# EAGLE schematic Sport Analyzer Chronojump Teensy 4 (4 buttons) (EAGLE 9.6.2)
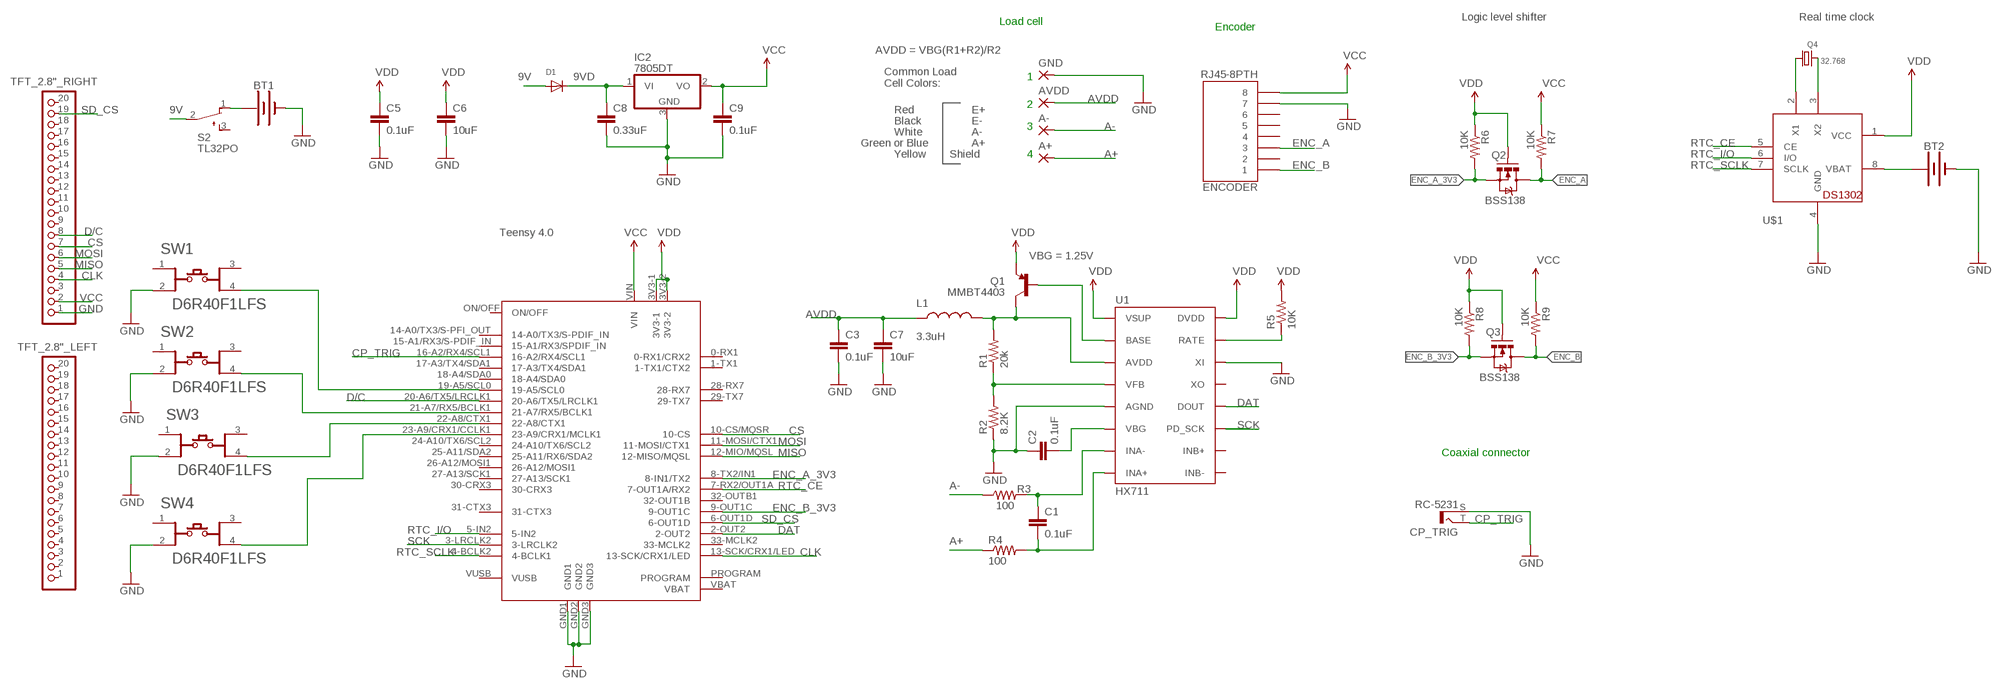
[diagram p0: schematic, sheet 1]

## Parts
A+  3,81/1,4  [3,81/1,4]
A-  3,81/1,4  [3,81/1,4]
AVDD  3,81/1,4  [3,81/1,4]
BT1  BATTERY-9V  [BATTCON_9V]
BT2  BATTERY-12MM_SMD  [BATTCON_12MM]
C1  0.1uF  0.1UF-25V-5%(0603)  [0603-CAP]
C2  0.1uF  0.1UF-25V-5%(0603)  [0603-CAP]
C3  0.1uF  0.1UF-25V-5%(0603)  [0603-CAP]
C5  0.1uF  0.1UF-25V-5%(0603)  [0603-CAP]
C6  10uF  10UF50V20%(1210)  [1210]
C7  10uF  10UF50V20%(1210)  [1210]
C8  0.33uF  0.1UF-25V-5%(0603)  [0603-CAP]
C9  0.1uF  0.1UF-25V-5%(0603)  [0603-CAP]
CP_TRIG  RC-5231  [RC-5231]
D1  DIODESOD-123  [SOD-123]
ENCODER  RJ45-8PTH  [RJ45-8]
GND  3,81/1,4  [3,81/1,4]
IC2  7805DT  [TO252]
L1  3.3uH  INDUCTOR0805-IND  [0805]
Q1  MMBT4403  TRANSISTOR_PNPMMBT4403  [SOT23-3]
Q2  BSS138  MOSFET-NCHANNELSMD  [SOT23-3]
Q3  BSS138  MOSFET-NCHANNELSMD  [SOT23-3]
Q4  32.768  CRYSTAL8.0X3.8  [CRYSTAL_8X3.8]
R1  20k  20KOHM1/10W1%(0603)  [0603-RES]
R2  8.2K  8.2KOHM-1/10W-5%(0603)  [0603-RES]
R3  100  100OHM-1/10W-1%(0603)  [0603-RES]
R4  100  100OHM-1/10W-1%(0603)  [0603-RES]
R5  10K  10KOHM-1/10W-1%(0603)0603  [0603-RES]
R6  10K  RESISTOR0603-RES  [0603-RES]
R7  10K  RESISTOR0603-RES  [0603-RES]
R8  10K  RESISTOR0603-RES  [0603-RES]
R9  10K  RESISTOR0603-RES  [0603-RES]
S2  TL32PO  [TL3XPO]
SW1  C&K_COMPONENTS_D6R40F1LFSC&K_COMPONENTS_D6R40F1LFS_0_0  [C&K_COMPONENTS_D6R40F1LFS_0]
SW2  C&K_COMPONENTS_D6R40F1LFSC&K_COMPONENTS_D6R40F1LFS_0_0  [C&K_COMPONENTS_D6R40F1LFS_0]
SW3  C&K_COMPONENTS_D6R40F1LFSC&K_COMPONENTS_D6R40F1LFS_0_0  [C&K_COMPONENTS_D6R40F1LFS_0]
SW4  C&K_COMPONENTS_D6R40F1LFSC&K_COMPONENTS_D6R40F1LFS_0_0  [C&K_COMPONENTS_D6R40F1LFS_0]
TFT_2.8"_LEFT  PINHD-1X20  [1X20]
TFT_2.8"_RIGHT  PINHD-1X20  [1X20]
U1  HX711  HX711HX711  [SO16]
U$1  DS1302  [DIL08-ROUND]
U$2  TEENSY40  [TEENSY40]

## Nets
9V: D1.A S2.2(P)
9VD: C8.1 D1.C IC2.1(VI)
A+: A+.1(P) R4.1
A-: A-.1(P) R3.1
AVDD: AVDD.1(P) C3.1 C7.1 L1.1
CLK: TFT_2.8"_RIGHT.4 U$2.13-SCK/CRX1/LED
CP_TRIG: CP_TRIG.T U$2.16-A2/RX4/SCL1
CS: TFT_2.8"_RIGHT.7 U$2.10-CS/MQSR(10-CS)
D/C: TFT_2.8"_RIGHT.8 U$2.20-A6/TX5/LRCLK1
DAT: U1.12(DOUT) U$2.2-OUT2
ENC_A: ENCODER.3 Q2.3(D) R7.2
ENC_A_3V3: Q2.2(S) R6.2 U$2.8-TX2/IN1(8-IN1/TX2)
ENC_B: ENCODER.1 Q3.3(D) R9.2
ENC_B_3V3: Q3.2(S) R8.2 U$2.9-OUT1C
GND: BT1.- BT2.GND(-) C2.1 C3.2 C5.2 C6.2 C7.2 C8.2 C9.2 CP_TRIG.S ENCODER.7 GND.1(P) IC2.3(GND) R2.1 SW1.2 SW2.2 SW3.2 SW4.2 TFT_2.8"_RIGHT.1 U1.5(AGND) U1.14(XI) U$1.4(GND) U$2.GND1 U$2.GND2 U$2.GND3
MISO: TFT_2.8"_RIGHT.5 U$2.12-MIO/MQSL(12-MISO/MQSL)
MOSI: TFT_2.8"_RIGHT.6 U$2.11-MOSI/CTX1
N$1: R5.1 U1.15(RATE)
N$2: C1.1 R3.2 U1.7(INA-)
N$3: C1.2 R4.2 U1.8(INA+)
N$4: Q1.1(B) U1.2(BASE)
N$5: L1.2 Q1.3(C) R1.2 U1.3(AVDD)
N$6: R1.1 R2.2 U1.4(VFB)
N$7: C2.2 U1.6(VBG)
N$8: Q4.P$4 U$1.2(X1)
N$9: Q4.P$1 U$1.3(X2)
N$10: SW1.4 U$2.19-A5/SCL0
N$11: SW2.4 U$2.21-A7/RX5/BCLK1
N$12: SW3.4 U$2.22-A8/CTX1
N$13: SW4.4 U$2.23-A9/CRX1/CCLK1(23-A9/CRX1/MCLK1)
N$18: BT2.PWR@1(+) U$1.8(VBAT)
N$42: BT1.+ S2.1(O)
RTC_CE: U$1.5(CE) U$2.7-RX2/OUT1A(7-OUT1A/RX2)
RTC_I/O: U$1.6(I/O) U$2.5-IN2
RTC_SCLK: U$1.7(SCLK) U$2.4-BCLK2(4-BCLK1)
SCK: U1.11(PD_SCK) U$2.3-LRCLK2
SD_CS: TFT_2.8"_RIGHT.19 U$2.6-OUT1D
VCC: C9.1 ENCODER.8 IC2.2(VO) R7.1 R9.1 TFT_2.8"_RIGHT.2 U$2.VIN
VDD: C5.1 C6.1 Q1.2(E) Q2.1(G) Q3.1(G) R5.2 R6.1 R8.1 U1.1(VSUP) U1.16(DVDD) U$1.1(VCC) U$2.3V3-1 U$2.3V3-2
Unconnected: ENCODER.2 ENCODER.4 ENCODER.5 ENCODER.6 S2.3(S) SW1.1 SW1.3 SW2.1 SW2.3 SW3.1 SW3.3 SW4.1 SW4.3 TFT_2.8"_LEFT.1 TFT_2.8"_LEFT.2 TFT_2.8"_LEFT.3 TFT_2.8"_LEFT.4 TFT_2.8"_LEFT.5 TFT_2.8"_LEFT.6 TFT_2.8"_LEFT.7 TFT_2.8"_LEFT.8 TFT_2.8"_LEFT.9 TFT_2.8"_LEFT.10 TFT_2.8"_LEFT.11 TFT_2.8"_LEFT.12 TFT_2.8"_LEFT.13 TFT_2.8"_LEFT.14 TFT_2.8"_LEFT.15 TFT_2.8"_LEFT.16 TFT_2.8"_LEFT.17 TFT_2.8"_LEFT.18 TFT_2.8"_LEFT.19 TFT_2.8"_LEFT.20 TFT_2.8"_RIGHT.3 TFT_2.8"_RIGHT.9 TFT_2.8"_RIGHT.10 TFT_2.8"_RIGHT.11 TFT_2.8"_RIGHT.12 TFT_2.8"_RIGHT.13 TFT_2.8"_RIGHT.14 TFT_2.8"_RIGHT.15 TFT_2.8"_RIGHT.16 TFT_2.8"_RIGHT.17 TFT_2.8"_RIGHT.18 TFT_2.8"_RIGHT.20 U1.9(INB-) U1.10(INB+) U1.13(XO) U$2.0-RX1(0-RX1/CRX2) U$2.1-TX1(1-TX1/CTX2) U$2.14-A0/TX3/S-PFI_OUT(14-A0/TX3/S-PDIF_IN) U$2.15-A1/RX3/S-PDIF_IN(15-A1/RX3/SPDIF_IN) U$2.17-A3/TX4/SDA1 U$2.18-A4/SDA0 U$2.24-A10/TX6/SCL2 U$2.25-A11/SDA2(25-A11/RX6/SDA2) U$2.26-A12/MOSI1 U$2.27-A13/SCK1 U$2.28-RX7 U$2.29-TX7 U$2.30-CRX3 U$2.31-CTX3 U$2.32-OUTB1(32-OUT1B) U$2.33-MCLK2 U$2.ON/OFF U$2.PROGRAM U$2.VBAT U$2.VUSB

## Notes on the sheet
- Logic level shifter | Real time clock
- Load cell
- Encoder
- AVDD = VBG(R1+R2)/R2
- 1
- Common Load
  Cell Colors:
- 2
- Red | E+
- Black | E-
- 3
- White | A-
- Green or Blue | A+
- Yellow | Shield | 4
- Teensy 4.0
- VBG = 1.25V
- Coaxial connector

## Library data of the parts
A+ A- AVDD GND = wirepad_xavi:3,81/1,4: THROUGH-HOLE PAD
BT1 = SparkFun-Batteries:BATTERY: Battery - Single Cell A variety of battery chemistries, sizes, and footprints. Device List: 20MM_PTH - Coin Cell Battery Holder - 20mm (PTH) <https://www.sparkfun.com/products/783> 20MM_PTH_KIT- Coin Cell battery Holder - 20 mm (PTH) <http://www.sparkfun.com/products/783>kit version with special mask 6.8MM_PTH - Coin Cell Battery Holder - 6.8MM(SMD) <https://www.digikey.com/product-detail/en/seiko-instruments/MS621FE-FL11E/728-1057-ND/1889208?WT.srch=1&gclid=CNOQ5a6LzdQCFZS2wAodXCkE0g> 12MM_SMD - Coin Cell Battery Holder - 12mm (SMD) <https://www.sparkfun.com/products/10592> 12MM_PTH - Coin Cell Battery Holder - 12mm (PTH) <https://www.sparkfun.com/products/7948> 20MM_SMD - 20mm Coin Cell Battery Holder (SMD) (2 legs) Used on the Big Time Watch Kit <https://www.sparkfun.com/products/11734> 20MM_SMD_4LEGS - Coin Cell Battery Holder - 20mm (SMD) <https://www.sparkfun.com/products/11892> 20MM_SMD_4LEGS_OVERPASTE - Coin Cell Battery Holder - 20mm (SMD) <https://www.sparkfun.com/products/11892> (Over-paste on the legs) 24.5MM_PTH - Coin Cell Battery Holder - 24.5mm (PTH) <https://www.sparkfun.com/products/8863> 9V - 9V Battery Holder - PC Mount Used on the SparkFun SparkPunk Sound Kit <https://www.sparkfun.com/products/11177> and SparkFun SparkPunk Sequencer Kit <https://www.sparkfun.com/products/12707> 18650 - Battery Holder - 18650 (PTH) <https://www.sparkfun.com/products/13113> AA - Battery Holder - 1xAA (PTH) <https://www.sparkfun.com/products/7949> AAA - Battery Holder - 1xAAA (PTH) <https://www.sparkfun.com/products/12718> AA_KIT - Battery Holder - 1xAA (PTH) <https://www.sparkfun.com/products/7949> Special kit package - pads only have exposed copper on one side of the board. AAA_KIT - Battery Holder - 1xAAA (PTH) <https://www.sparkfun.com/products/12718> Special kit package - pads only have exposed copper on one side of the board.; PROD_ID: BATT-10855
BT2 = SparkFun-Batteries:BATTERY: Battery - Single Cell A variety of battery chemistries, sizes, and footprints. Device List: 20MM_PTH - Coin Cell Battery Holder - 20mm (PTH) <https://www.sparkfun.com/products/783> 20MM_PTH_KIT- Coin Cell battery Holder - 20 mm (PTH) <http://www.sparkfun.com/products/783>kit version with special mask 6.8MM_PTH - Coin Cell Battery Holder - 6.8MM(SMD) <https://www.digikey.com/product-detail/en/seiko-instruments/MS621FE-FL11E/728-1057-ND/1889208?WT.srch=1&gclid=CNOQ5a6LzdQCFZS2wAodXCkE0g> 12MM_SMD - Coin Cell Battery Holder - 12mm (SMD) <https://www.sparkfun.com/products/10592> 12MM_PTH - Coin Cell Battery Holder - 12mm (PTH) <https://www.sparkfun.com/products/7948> 20MM_SMD - 20mm Coin Cell Battery Holder (SMD) (2 legs) Used on the Big Time Watch Kit <https://www.sparkfun.com/products/11734> 20MM_SMD_4LEGS - Coin Cell Battery Holder - 20mm (SMD) <https://www.sparkfun.com/products/11892> 20MM_SMD_4LEGS_OVERPASTE - Coin Cell Battery Holder - 20mm (SMD) <https://www.sparkfun.com/products/11892> (Over-paste on the legs) 24.5MM_PTH - Coin Cell Battery Holder - 24.5mm (PTH) <https://www.sparkfun.com/products/8863> 9V - 9V Battery Holder - PC Mount Used on the SparkFun SparkPunk Sound Kit <https://www.sparkfun.com/products/11177> and SparkFun SparkPunk Sequencer Kit <https://www.sparkfun.com/products/12707> 18650 - Battery Holder - 18650 (PTH) <https://www.sparkfun.com/products/13113> AA - Battery Holder - 1xAA (PTH) <https://www.sparkfun.com/products/7949> AAA - Battery Holder - 1xAAA (PTH) <https://www.sparkfun.com/products/12718> AA_KIT - Battery Holder - 1xAA (PTH) <https://www.sparkfun.com/products/7949> Special kit package - pads only have exposed copper on one side of the board. AAA_KIT - Battery Holder - 1xAAA (PTH) <https://www.sparkfun.com/products/12718> Special kit package - pads only have exposed copper on one side of the board.; PROD_ID: BATT-08044; SF_SKU: PRT-10592
C1-C3 C5 C9 = SparkFun-Capacitors:0.1UF-25V-5%(0603): CAP-08604; PROD_ID: CAP-08604
C6 C7 = SparkFun-Capacitors:10UF50V20%(1210): CAP-09824; PROD_ID: CAP-09824
C8 = SparkFun-Capacitors:0.1UF-25V-5%(0603): CAP-08604; PROD_ID: CAP-08604; VALUE: 0.1uF
CP_TRIG = con-lumberg:RC-5231: RCA connectors according to JEITA RC-5231 RCA-Steckverbinder nach JEITA RC-5231 Source: RCA- Stecker 2poolig.pdf
D1 = adafruit:DIODE: Diode SMADIODE - SMA Surface Mount Package 20V 1A Schottky Diode Digikey: 641-1014-6-ND DO-1N4148 - Through Hole Small Current Diode SOD-123 20V 1 A (.5mV Vf) Schottky Diode - Digikey: MBRX120TPMSCT-ND SOD-323 10V 570mA (.38mV Vf, 3ns) Schottky Diode - Digikey: ZLLS410CT-ND SOD-523 30V 30mA Schottky Diode (RB751S-40TE61) - Digikey: RB751S-40TE61CT-ND SOT23-R/W - SOT23 Package (R = Solder Paste/Reflow Ovens, W = Hand-Soldering) BAT54Film 40V 300mA - Digikey: 497-7162-1-ND
ENCODER = SparkFun:RJ45-8: RJ45 Jack Simple RJ45, 8-pin connection - connector for common Cat5, Cat5e, and Cat6 Ethernet cables. Footprint not yet proven in production. Connector sku is PRT-00643; Breakout PCB sku is BOB-00716.
IC2 = linear:78*: Positive VOLTAGE REGULATOR Source: http://cache.national.com/ds/LM/LM78L05.pdf http://www.fairchildsemi.com/ds/LM/LM7805.pdf
L1 = SparkFun-Passives:INDUCTOR: Inductors Basic Inductor/Choke - 0603 and 1206. Footprints are not proven and vary greatly between part numbers. INDUCTOR POWER 3.3UH 4.0A SMD 0.197" L x 0.197" W x 0.177" H (5.00mm x 5.00mm x 4.50mm); PROD_ID: NDUC-13076
Q1 = SparkFun-DiscreteSemi:TRANSISTOR_PNP: Generic PNP BJT Double check pinouts against datasheets- not all devices are the same! MMBT3906 - 40V 200mA SOT-23 (TRANS-08052) MMBT4403 - 40V 600mA SOT-23 (TRANS-09245); PROD_ID: TRANS-09245
Q2 Q3 = SparkFun:MOSFET-NCHANNEL
Q4 = microbuilder:CRYSTAL: Crystals HC49UP - Surface Mount Crystal 4.0MHz 18pF +/-30ppm Surface Mount Crystal [Digikey: 535-9857-1-ND] 12.0 MHz Surface Mount Crystal [Digikey: 535-9869-6-ND] 25.0 MHz Surface Mount Crystal [Digikey: 535-9078-1-ND] 2.5 x 2.0mm - MEMs SMT Crystal 16.0 MHz 10pF 20ppm 2.5 x 2.0mm Crystal [Digikey -40-85°C: 535-10923-1-ND] 3.2 x 2.5mm - MEMs SMT Crystal 12.0 MHz 8pF 15ppm 3.2 x 2.5mm Crystal [Digikey: -10-70°C: 644-1047-1-ND -40-125°C: 644-1128-1-ND] 40~85°C cheaper: 644-1173-6-ND 16.0 MHz 8pF 15ppm 3.2 x 2.5mm Crystal [Digikey: -10-70°C: 644-1049-1-ND -40-125°C: 644-1129-2-ND]-40~85°C cheaper: 644-1175-6-ND 16.0 MHz 10pF 10ppm 3.2 x 2.5mm Crystal [Digikey: 644-1100-1-ND] 27.12 MHz 18pF 30ppm 3.2 x 2.5mm Crystal [Digikey: 887-1424-1-ND] 27.12MHz 10pF 10ppm 3.2 x 2.5mm Crystal [Digikey: 887-1329-1-ND] 4.9 x 1.8mm - MEMs SMT Crystal 32.768 KHz 12.5pF 20ppm 4.9 x 1.8mm Crystal [Digikey: SE2415CT-ND] 8.0 x 3.8mm - Surface Mount Crystal 32.768kHz 12.5pF 20ppm -40°C-85°C [Digikey: 535-9166-2-ND] Cylinder 32.768KHz Cylinder Crystal (2x6mm body) [Ex. Digikey: 300-8341-2-ND]
R1 = SparkFun-Resistors:20KOHM1/10W1%(0603): RES-09383; PROD_ID: RES-09383
R2 = SparkFun-Resistors:8.2KOHM-1/10W-5%(0603): RES-10646; PROD_ID: RES-10646
R3 R4 = SparkFun-Resistors:100OHM-1/10W-1%(0603): RES-07863; PROD_ID: RES-07863
R5 = SparkFun-Resistors:10KOHM-1/10W-1%(0603): RES-00824; PROD_ID: RES-00824
R6-R9 = SparkFun:RESISTOR: Resistor Basic schematic elements and footprints for 0603, 1206, and PTH resistors.
S2 = switch:TL32PO: TINY SWITCH ON - MOM Source: http://www2.produktinfo.conrad.com/datenblaetter/700000-724999/705152-da-01-de-Subminiaturschalter_TL_36YO.pdf
SW1-SW4 = C&K Components - D6R40F1LFS:C&K_COMPONENTS_D6R40F1LFS: Pushbutton Switch SPST-NO, RED, 0.1A, 32VDC, Through Hole; AUTOMOTIVE: No; CENTROID_NOT_SPECIFIED: No; CONTACT_CURRENT_RATING: 100mA; CONTACT_RESISTANCE: 100mΩ; DATASHEET: https://www.ckswitches.com/media/1341/d6.pdf; DEVICE_CLASS_L1: Electromechanical; DEVICE_CLASS_L2: Switches; DEVICE_CLASS_L3: Pushbutton Switches; DIGIKEY_DESCRIPTION: SWITCH PUSH SPST-NO 0.1A 32V; DIGIKEY_PART_NUMBER: 401-1975-ND; ELECTROMECHANICAL_LIFE: 250000Cycles; FOOTPRINT_VARIANT_NAME_0: Recommended_Land_Pattern; HEIGHT: 14.3mm; LEAD_FREE: Yes; MF: C&K Components; MFG_PACKAGE_IDENT: 0; MFG_PACKAGE_IDENT_DATE: 0; MFG_PACKAGE_IDENT_REV: 0; MOUNT: Through Hole; MOUSER_DESCRIPTION: Switch; P/B; Keyswitch; SPST-NO; OFF-MOM; Red Round Actuator; 100mA; 32VDC; PC Pins; MOUSER_PART_NUMBER: 611-D6R40F1LFS; MPN: D6R40F1LFS; OPERATING_FORCE: 1.3N; PACKAGE: PTH_SW_12MM0; PREFIX: SW; ROHS: Yes; STANDOFF_HEIGHT: 1.5mm; TEMPERATURE_RANGE_HIGH: +85°C; TEMPERATURE_RANGE_LOW: -20°C; THROW_CONFIGURATION: SPST-NO; VERIFICATION_VERSION: 0.0.0.3; VOLTAGE_RATING_DC: 32V
TFT_2.8"_LEFT TFT_2.8"_RIGHT = pinhead:PINHD-1X20: PIN HEADER
U1 = Testing:HX711; PROD_ID: IC-12445
U$1 = adafruit:DS1302: DS1302 - Real time clock with supercap trickle charger
U$2 = teensy:TEENSY40: Teensy 4.0 device including POGO pins for pins 24 - 33, but not yet pins for D+ and D-. Symbol layout is what works for me and may not suite everyone... that can be added or additional symbols can be created to be used in a modilied davie name.